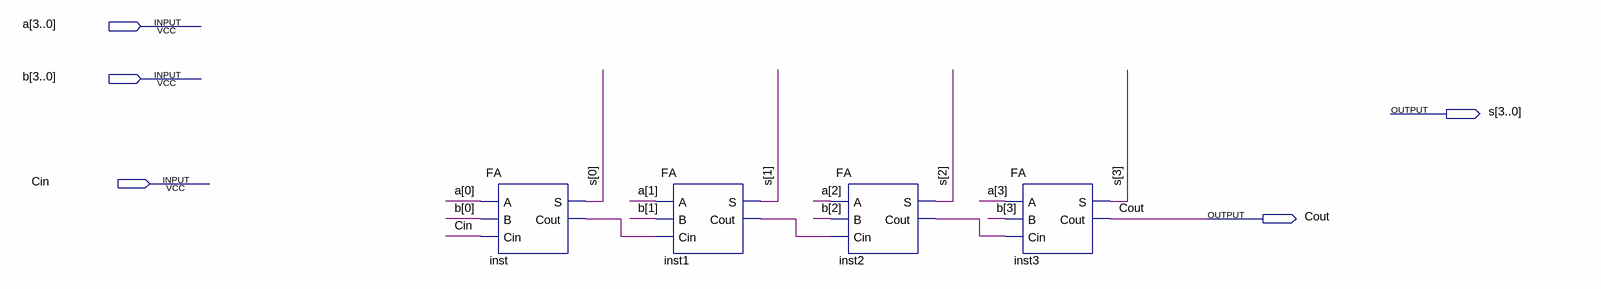
[diagram p0: schematic sheet]
// Quartus schematic RCA.bdf as structural Verilog: 4 symbols, 5 pins
module RCA (
  input  [3:0] a,
  input  [3:0] b,
  input  Cin,
  output [3:0] s,
  output Cout
);

  wire inst1_cout, inst2_cout, inst_cout;

  FA inst (.A(a[0]), .B(b[0]), .Cin(Cin), .S(s[0]), .Cout(inst_cout));
  FA inst1 (.A(a[1]), .B(b[1]), .Cin(inst_cout), .S(s[1]), .Cout(inst1_cout));
  FA inst2 (.A(a[2]), .B(b[2]), .Cin(inst1_cout), .S(s[2]), .Cout(inst2_cout));
  FA inst3 (.A(a[3]), .B(b[3]), .Cin(inst2_cout), .S(s[3]), .Cout(Cout));
endmodule
